# EAGLE design 1.81_Grayscale_OLED_Breakout (EAGLE 7.7.0)
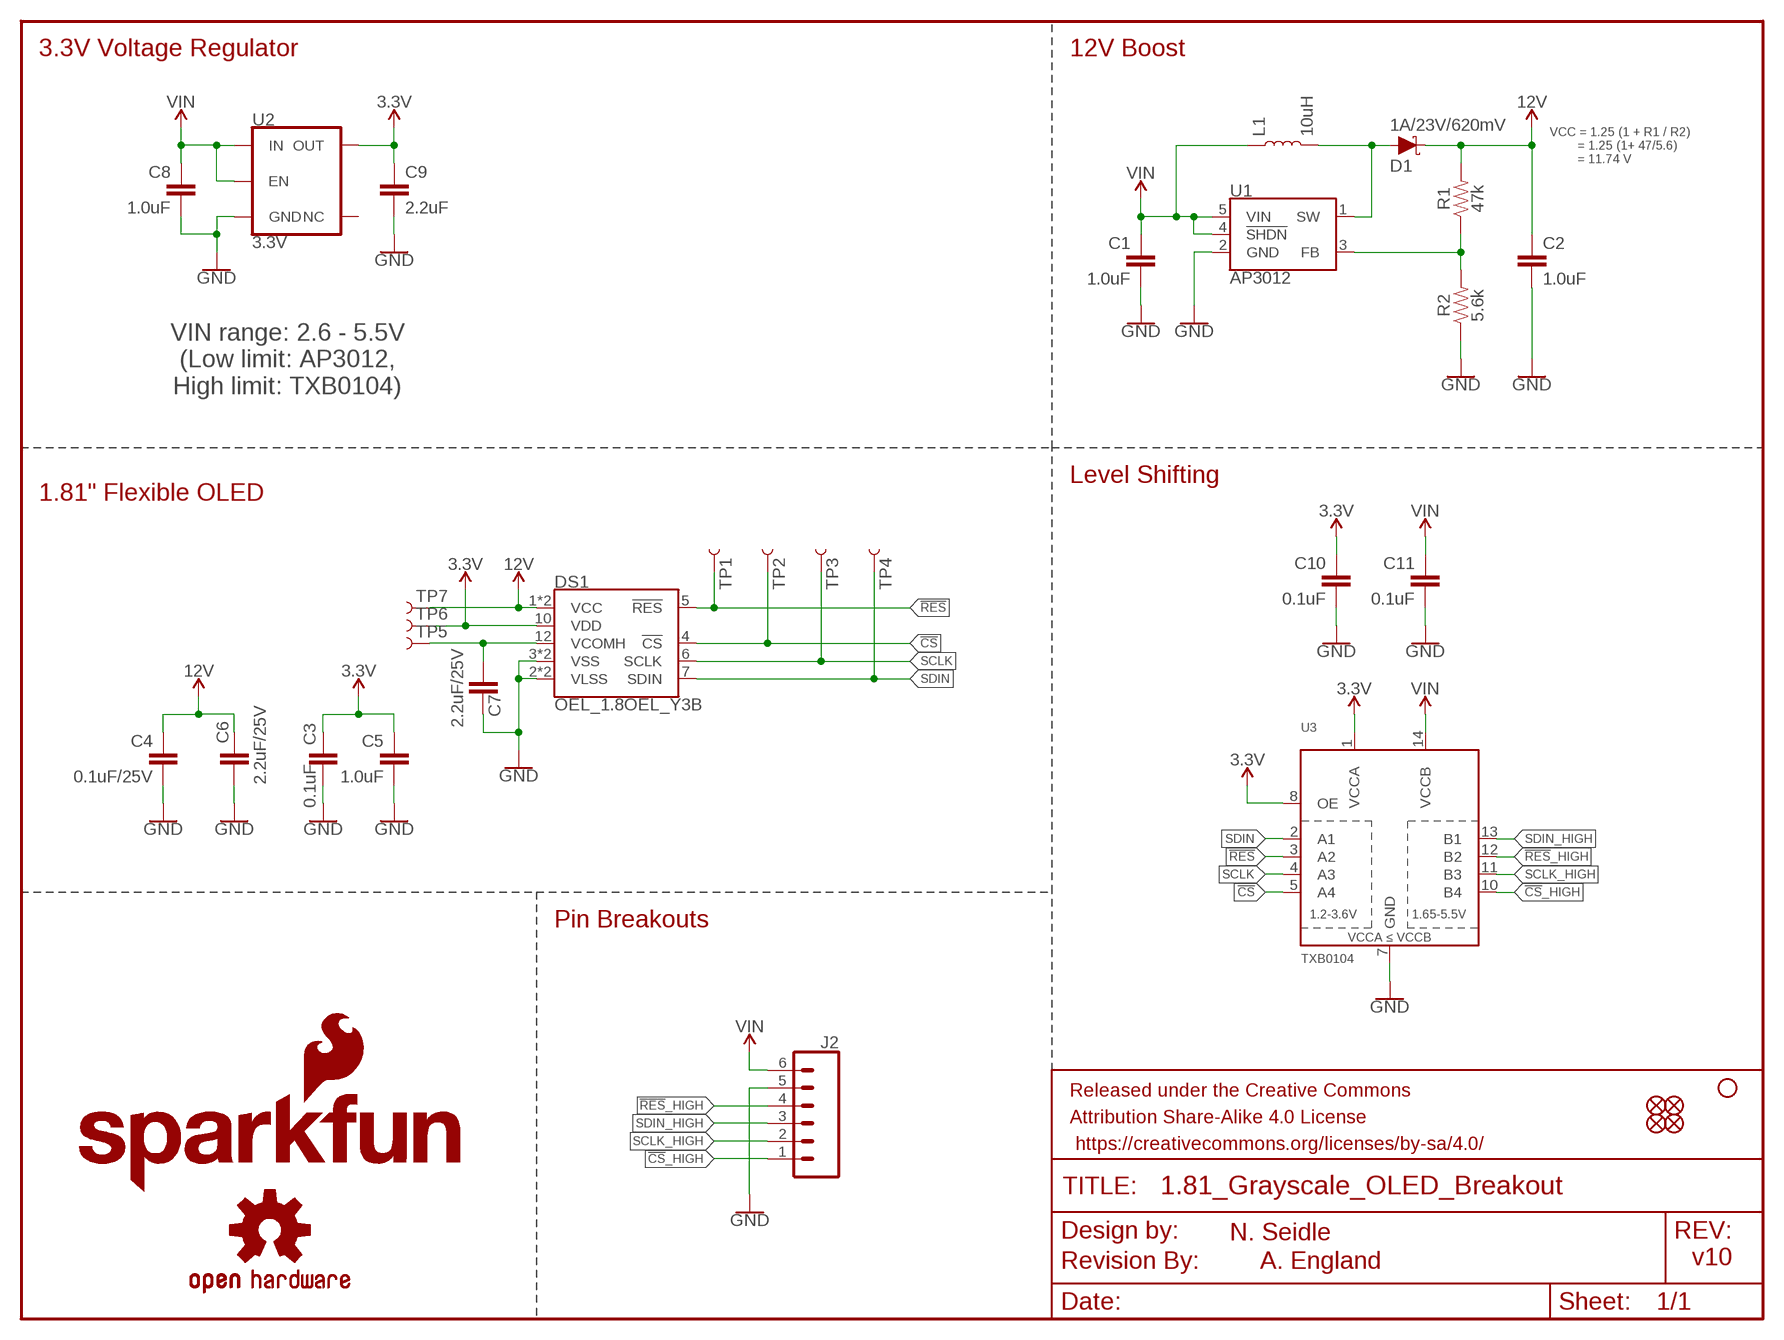
[diagram p0: schematic, sheet 1]

## Parts
C1  1.0uF  1.0UF-0603-16V-10%  [0603]
C2  1.0uF  1.0UF-0805-25V-10%  [0805]
C3  0.1uF  0.1UF-0603-25V-(+80/-20%)  [0603]
C4  0.1uF/25V  0.1UF-0603-25V-(+80/-20%)  [0603]
C5  1.0uF  1.0UF-0603-16V-10%  [0603]
C6  2.2uF/25V  2.2UF-0805-25V-(+80/-20%)  [0805]
C7  2.2uF/25V  2.2UF-0805-25V-(+80/-20%)  [0805]
C8  1.0uF  1.0UF-0603-16V-10%  [0603]
C9  2.2uF  2.2UF-0603-10V-20%  [0603]
C10  0.1uF  0.1UF-0603-25V-(+80/-20%)  [0603]
C11  0.1uF  0.1UF-0603-25V-(+80/-20%)  [0603]
D1  1A/23V/620mV  DIODE-SCHOTTKY-BAT20J  [SOD-323]
DS1  OEL_1.8OEL_Y3B  [OEL_1.8_FPC_Y3B]
FD1  FIDUCIAL1X2  [FIDUCIAL-1X2]
FD2  FIDUCIAL1X2  [FIDUCIAL-1X2]
FD3  FIDUCIAL1X2  [FIDUCIAL-1X2]
FD4  FIDUCIAL1X2  [FIDUCIAL-1X2]
FRAME1  FRAME-LETTER  [CREATIVE_COMMONS]
H2  STAND-OFF  [STAND-OFF]
J2  CONN_06NO_SILK_NO_POP  [1X06_NO_SILK]
L1  10uH  INDUCTOR-CDRH-10UH  [INDUCTOR_4.7UH]
LOGO1  SFE_LOGO_NAME_FLAME.1_INCH  [SFE_LOGO_NAME_FLAME_.1]
LOGO2  REVISION  [REVISION]
LOGO3  SFE_LOGO_FLAME.1_INCH  [SFE_LOGO_FLAME_.1]
LOGO4  OSHW-LOGOS  [OSHW-LOGO-S]
R1  47k  47KOHM-0603-1/10W-1%  [0603]
R2  5.6k  5.6KOHM-0603-1/10W-1%  [0603]
TP1  TEST-POINT3  [PAD.03X.03]
TP2  TEST-POINT3  [PAD.03X.03]
TP3  TEST-POINT3  [PAD.03X.03]
TP4  TEST-POINT3  [PAD.03X.03]
TP5  TEST-POINT3  [PAD.03X.03]
TP6  TEST-POINT3  [PAD.03X.03]
TP7  TEST-POINT3  [PAD.03X.03]
U1  AP3012  [SOT23-5]
U2  3.3V  V_REG_AP2112K-3.3V  [SOT23-5]
U3  TXB0104  TXB0104PWRSOIC14  [SO14]

## Nets
3.3V: C3.1 C5.1 C9.1 C10.1 DS1.10(VDD) TP6.P$1 U2.5(OUT) U3.1(VCCA) U3.8(OE)
12V: C2.1 C4.1 C6.1 D1.C DS1.1(VCC) DS1.13(VCC) R1.2 TP7.P$1
!CS!: DS1.4(!CS!) TP2.P$1 U3.5(A4)
!CS!_HIGH: J2.1 U3.10(B4)
!RES!: DS1.5(!RES!) TP1.P$1 U3.3(A2)
!RES!_HIGH: J2.4 U3.12(B2)
GND: C1.2 C2.2 C3.2 C4.2 C5.2 C6.2 C7.1 C8.2 C9.2 C10.2 C11.2 DS1.2(VLSS) DS1.3(VSS) DS1.8(VSS) DS1.9(VLSS) J2.5 R2.1 U1.2(GND) U2.2(GND) U3.7(GND)
N$1: C7.2 DS1.12(VCOMH) TP5.P$1
N$2: D1.A L1.P$2 U1.1(SW)
N$3: R1.1 R2.2 U1.3(FB)
SCLK: DS1.6(SCLK) TP3.P$1 U3.4(A3)
SCLK_HIGH: J2.2 U3.11(B3)
SDIN: DS1.7(SDIN) TP4.P$1 U3.2(A1)
SDIN_HIGH: J2.3 U3.13(B1)
VIN: C1.1 C8.1 C11.1 J2.6 L1.P$1 U1.4(!SHDN!) U1.5(VIN) U2.1(IN) U2.3(EN) U3.14(VCCB)
Unconnected: U2.4(NC)

## Notes on the sheet
- 3.3V Voltage Regulator | 12V Boost
- VCC = 1.25 (1 + R1 / R2)
          = 1.25 (1+ 47/5.6)
          = 11.74 V
- VIN range: 2.6 - 5.5V
  (Low limit: AP3012,
  High limit: TXB0104)
- Level Shifting
- 1.81" Flexible OLED
- Pin Breakouts
- N. Seidle
- A. England | v10

## Library data of the parts
C1 C5 C8 = SparkFun-Capacitors:1.0UF: 1µF ceramic capacitors A capacitor is a passive two-terminal electrical component used to store electrical energy temporarily in an electric field.; PROD_ID: CAP-00868
C2 = SparkFun-Capacitors:1.0UF: 1µF ceramic capacitors A capacitor is a passive two-terminal electrical component used to store electrical energy temporarily in an electric field.; PROD_ID: CAP-08064
C3 C10 C11 = SparkFun-Capacitors:0.1UF: 0.1µF ceramic capacitors A capacitor is a passive two-terminal electrical component used to store electrical energy temporarily in an electric field.; PROD_ID: CAP-00810
C4 = SparkFun-Capacitors:0.1UF: 0.1µF ceramic capacitors A capacitor is a passive two-terminal electrical component used to store electrical energy temporarily in an electric field.; PROD_ID: CAP-00810; VALUE: 0.1uF
C6 C7 = SparkFun-Capacitors:2.2UF: 2.2µF ceramic capacitors A capacitor is a passive two-terminal electrical component used to store electrical energy temporarily in an electric field.; PROD_ID: CAP-11624; VALUE: 2.2uF
C9 = SparkFun-Capacitors:2.2UF: 2.2µF ceramic capacitors A capacitor is a passive two-terminal electrical component used to store electrical energy temporarily in an electric field.; PROD_ID: CAP-07888
D1 = SparkFun-DiscreteSemi:DIODE-SCHOTTKY: Schottky diode A Schottky diode is a semiconductor diode which has a low forward voltage drop and a very fast switching action.; PROD_ID: DIO-11623
DS1 = SparkFun-Displays:OEL_1.8: WiseChip SSD1320 - 1.80" Flexible Grayscale OLED 1.80" 160*32 pixel flexible grayscale OLED display; PROD_ID: LCD-13910, CONN-13933
FD1-FD4 = SparkFun-Aesthetics:FIDUCIAL: Fiducial Alignment Points Point-of-reference for pick-and-place machines and other optical instruments.
FRAME1 = SparkFun-Aesthetics:FRAME-LETTER: Schematic Frame - Letter Standard 8.5x11 US Letter frame
H2 = SparkFun-Hardware:STAND-OFF: Stand Off Drill holes for mechanically mounting via screws, standoffs, etc. Note: Use the keepout ring to avoid running the screw head into surrounding components. Variant Overviews STAND-OFF - Mechanical footprint for a #4 phillips button head screw. STAND-OFF-TIGHT - Mechanical footprint for a #4 phillips button head screw, Example SparkFun Products Screw - Phillips Head (1/4", 4-40, 10 pack) <https://www.sparkfun.com/products/10453> (PRT-10453) Screw - Phillips Head (1/2", 4-40, 10 pack) <https://www.sparkfun.com/products/10452> (PRT-10452) Screw - Phillips Head (3/4", 4-40, 10 pack) <https://www.sparkfun.com/products/10451> (PRT-10451) Screw - Phillips Head (1", 4-40, 10 pack) <https://www.sparkfun.com/products/10450> (PRT-10450)
J2 = SparkFun-Connectors:CONN_06: Multi connection point. Often used as Generic Header-pin footprint for 0.1 inch spaced/style header connections On any of the 0.1 inch spaced packages, you can populate with these: Break Away Headers - Straight <https://www.sparkfun.com/products/116> (PRT-00116) Break Away Male Headers - Right Angle <https://www.sparkfun.com/products/553> (PRT-00553) Female Headers <https://www.sparkfun.com/products/115> (PRT-00115) Break Away Headers - Machine Pin <https://www.sparkfun.com/products/117> (PRT-00117) Break Away Female Headers - Swiss Machine Pin <https://www.sparkfun.com/products/743> (PRT-00743) Arduino Stackable Header - 6 Pin <https://www.sparkfun.com/products/9280> (PRT-09280) For SCREWTERMINALS and SPRING TERMINALS visit here: Screw Terimnals on SparkFun.com <https://www.sparkfun.com/search/results?term=Screw+Terminals> (5mm/3.5mm/2.54mm spacing) This device is also useful as a general connection point to wire up your design to another part of your project. Our various solder wires solder well into these plated through hole pads. Hook-Up Wire - Assortment (Stranded, 22 AWG) <https://www.sparkfun.com/products/11375> (PRT-11375) Hook-Up Wire - Assortment (Solid Core, 22 AWG) <https://www.sparkfun.com/products/11367> (PRT-11367) View the entire wire category on our website here <https://www.sparkfun.com/categories/141>
L1 = SparkFun-Coils:INDUCTOR: Inductors Resist changes in electrical current. Basically a coil of wire. SparkFun Products: SparkFun Load Cell Amplifier - HX711 <https://www.sparkfun.com/products/13879> IOIO-OTG - V2.2 <https://www.sparkfun.com/products/13613>; PROD_ID: NDUC-13968
LOGO1 = SparkFun-Aesthetics:SFE_LOGO_NAME_FLAME: SparkFun Font Logo w/ Flame This is the SparkFun full logo. The logo on the schematic will always be the same size; the package variant is the height of the flame part of the logo. Default layer for the logo on the board is tSilk.
LOGO2 = SparkFun-Aesthetics:REVISION: "Revision By" Text Preceding text for revisor documentation. Includes schematic text on "symbols" layer, and board text on tDoc.
LOGO3 = SparkFun-Aesthetics:SFE_LOGO_FLAME: SparkFun Flame Logo This is the SparkFun flame logo. The logo on the schematic will always be the same size; the package variant is the height of the flame. Default layer for the logo on the board is tSilk.
LOGO4 = SparkFun-Aesthetics:OSHW-LOGO: Open-Source Hardware (OSHW) Logo This logo indicates the piece of hardware it is found on incorporates a OSHW license and/or adheres to the definition of open source hardware found here: http://freedomdefined.org/OSHW
R1 = SparkFun-Resistors:47KOHM: 47kΩ resistor A resistor is a passive two-terminal electrical component that implements electrical resistance as a circuit element. Resistors act to reduce current flow, and, at the same time, act to lower voltage levels within circuits. - Wikipedia; PROD_ID: RES-07871
R2 = SparkFun-Resistors:5.6KOHM: 5.6kΩ resistor A resistor is a passive two-terminal electrical component that implements electrical resistance as a circuit element. Resistors act to reduce current flow, and, at the same time, act to lower voltage levels within circuits. - Wikipedia; PROD_ID: RES-12378
TP1-TP7 = SparkFun-Connectors:TEST-POINT: SparkFun Test Points Bare copper test points for troubleshooting or In-Circuit-Testing. These are used by our Production team for verifying production board runs using pogo-pins on test beds. SparkFun Products: SparkFun LSM9DS1 Breakout <https://www.sparkfun.com/products/13284> SparkFun PSOC <https://www.sparkfun.com/products/13714> SparkFun Load Cell Amplifier <https://www.sparkfun.com/products/13879>
U1 = SparkFun-IC-Power:AP3012: AP3012 The AP3012 is a high power, constant frequency, current mode PWM, inductor based, step-up (boost) converter. The converter operates at high frequency (1.5MHz) so that a small, low profile inductor can be used. Datasheet <https://www.diodes.com/assets/Datasheets/AP3012.pdf>; PROD_ID: VREG-13911
U2 = SparkFun-IC-Power:V_REG_AP2112: AP2112 - 600mA CMOS LDO Regulator w/ Enable The AP2112 is CMOS process low dropout linear regulator with enable function, the regulator delivers a guaranteed 600mA (min.) continuous load current. Features Output Voltage Accuracy: ±1.5% Output Current: 600mA (Min.) Foldback Short Current Protection: 50mA Enable Function to Turn ON/OFF VOUT Low Dropout Voltage (3.3V): 250mV (Typ.) @IOUT=600mA Excellent Load Regulation: 0.2%/A (Typ.) Excellent Line Regulation: 0.02%/V (Typ.) Low Quiescent Current: 55μA (Typ.) Low Standby Current: 0.01μA (Typ.) Low Output Noise: 50μVRMS PSRR: 100Hz -65dB, 1kHz -65dB OTSD Protection Stable with 1.0μF Flexible Cap: Ceramic, Tantalum and Aluminum Electrolytic Operation Temperature Range: -40°C to 85°C ESD: MM 400V, HBM 4000V; PROD_ID: VREG-12457
U3 = SparkFun-IC-Comms:TXB0104PWR: 4-Bit Bi-Directional Level Shifter 1.2V-3.6V (VCCA) to 1.65V-5.5V (VCCB) bi-directional level shifter with auto direction sensing. Max data rate - VCCA 1.8V: 20Mbps (50ns), VCCA 3.3V: 100Mbps (10ns) Digikey: 296-21929-1-ND (TSSOP) Datasheet <http://cdn.sparkfun.com/datasheets/BreakoutBoards/txb0104.pdf> SparkFun Products SparkFun Cellular Shield - MG2639 <https://www.sparkfun.com/products/13120> (CEL-13120) SparkFun Level Shifting microSD Breakout <https://www.sparkfun.com/products/13743> (DEV-13743) SparkFun Voltage-Level Translator Breakout - TXB0104 <https://www.sparkfun.com/products/11771> (BOB-11771) SparkFun Block for Intel® Edison - UART <https://www.sparkfun.com/products/13040> (DEV-13040) SparkFun Block for Intel® Edison - Arduino <https://www.sparkfun.com/products/13036> (DEV-13036); PROD_ID: IC-11329

## Board
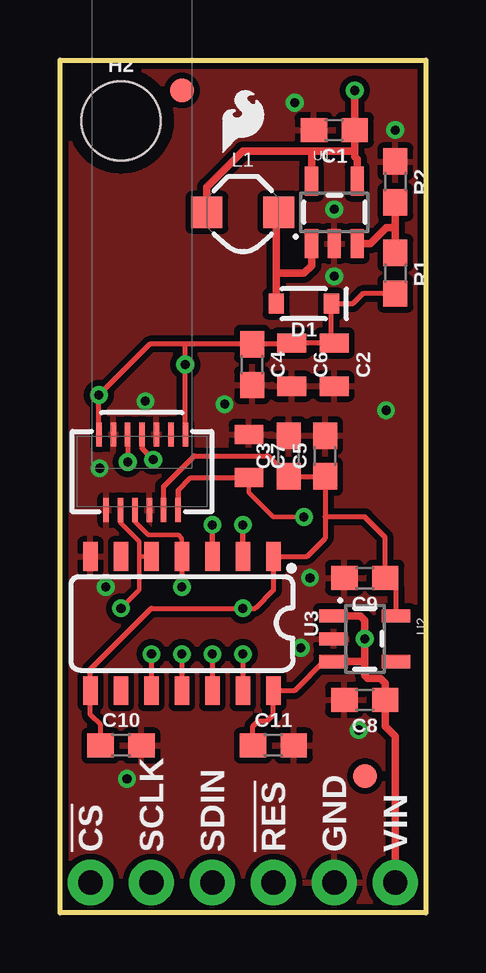
[diagram p1: board, top side]
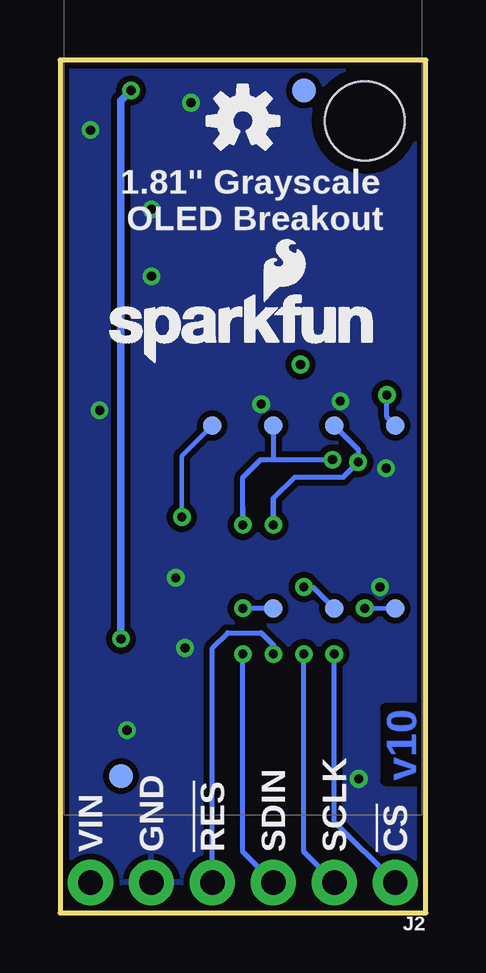
[diagram p2: board, bottom side, seen from below]

Size 15.24 x 35.56 mm. Coordinates in mm from the lower left corner, seen from the top.
Outline: 15.24,0 0,0 0,35.56 15.24,35.56 15.24,0
Copper layers (1*16): Top 0.035mm / dielectric 1.5mm / Bottom 0.035mm
Design rules "SparkFun-2-layer-TIGHT": minimum track width 7mil, minimum drill 15mil, track to track 7mil, track to pad 7mil, pad to pad 7mil, via to via 7mil, smd to smd 7mil, copper to edge 7mil, drill to drill 7mil, minimum pad ring 7mil, minimum via ring 7mil, stop-mask expansion 4mil, vias tented up to drill 25mil, thermal gap 10mil

### Footprints (pad centres in the part's own frame; a part is rotated, then mirrored left to right if it is on the bottom)
0603 = smd 1.1 x 1: 1 -0.85,0; 2 0.85,0
0805 = smd 0.8 x 1.2: 1 -0.9,0; 2 0.9,0
SOD-323 = smd 0.63 x 0.83: A 1.15,0; C -1.15,0
OEL_1.8_FPC_Y3B = smd 0.23 x 1 bottom: 1 6,-11.795; 2 5.7,-14.955; 3 5.4,-11.795; 4 5.1,-14.955; 5 4.8,-11.795; 6 4.5,-14.955; 7 4.2,-11.795; 8 3.9,-14.955; 9 3.6,-11.795; 10 3.3,-14.955; 11 3,-11.795; 12 2.7,-14.955; 13 2.4,-11.795
FIDUCIAL-1X2 = smd 1 x 1: 1 0,0
STAND-OFF = hole 3.302: 0,0
1X06_NO_SILK = drill 1.016 pad 1.88: 1 0,0; 2 2.54,0; 3 5.08,0; 4 7.62,0; 5 10.16,0; 6 12.7,0
INDUCTOR_4.7UH = smd 1.3 x 1.3: P$1 -1.5,0; P$2 1.5,0
PAD.03X.03 = smd 0.762 x 0.762: P$1 0,0
SOT23-5 = smd 0.55 x 1.2: 1 -0.95,-1.3; 2 0,-1.3; 3 0.95,-1.3; 4 0.95,1.3; 5 -0.95,1.3
SO14 = smd 0.6 x 1.2: 1 -3.81,-2.8; 2 -2.54,-2.8; 3 -1.27,-2.8; 4 0,-2.8; 5 1.27,-2.8; 6 2.54,-2.8; 7 3.81,-2.8; 8 3.81,2.8; 9 2.54,2.8; 10 1.27,2.8; 11 0,2.8; 12 -1.27,2.8; 13 -2.54,2.8; 14 -3.81,2.8

### Placement (x,y rotation side)
C1  11.43,32.64 180 top
C2  11.43,22.86 270 top
C3  9.53,19.05 90 top
C4  8,22.86 270 top
C5  11.05,19.05 90 top
C6  9.65,22.86 270 top
C7  7.87,19.05 270 top
C8  12.7,8.89 180 top
C9  12.7,13.97 180 top
C10  2.54,6.99 0 top
C11  8.89,6.99 0 top
D1  10.16,25.4 180 top
DS1  7.62,31.75 0 bottom
FD1  12.7,5.71 0 top
FD2  5.08,34.29 0 top
FD3  12.7,5.71 0 bottom
FD4  5.08,34.29 0 bottom
FRAME1  -22.86,-8.89 0 top  (outside the outline)
H2  2.54,33.02 0 top
J2  1.27,1.27 180 bottom
L1  7.62,29.21 0 top
LOGO1  13.59,22.86 0 bottom
LOGO2  -11.43,-11.43 0 top  (outside the outline)
LOGO3  6.48,31.37 0 top
LOGO4  7.62,33.02 0 bottom
R1  13.97,26.67 270 top
R2  13.97,30.48 270 top
TP1  3.81,20.32 0 bottom
TP2  1.27,12.7 0 bottom
TP3  3.81,12.7 0 bottom
TP4  6.35,20.32 0 bottom
TP5  8.89,20.32 0 bottom
TP6  6.35,12.7 0 bottom
TP7  1.27,20.32 0 bottom
U1  11.43,29.21 0 top
U2  12.7,11.43 270 top
U3  5.08,12.06 180 top

### Tracks (layer width: path | path; a pad name or v marks a point on that pad's centre or on a via)
3.3V  (via drill 0.38)
  Top 0.203: U2.5 14,13.52 C9.1 13.55,15.66 12.7,16.51 11.05,16.51 | 11.05,16.51 C5.1 C3.1 8.68,19.05 5.59,19.05 4.32,17.78 DS1.10 | 11.05,16.51 11.05,15.62 10.29,14.87 U3.1 8.89,13.46 8.13,12.7 v7.62,12.7 3.81,12.7 1.27,10.16 U3.8 1.27,8.26 1.69,7.83 C10.1
  Bottom 0.203: TP6.P$1 v7.62,12.7
12V  (via drill 0.38)
  Top 0.203: DS1.1 v1.62,21.59 3.74,23.71 5.21,23.71 | 5.21,23.71 C4.1 9.6,23.71 C6.1 C2.1 11.31,23.88 D1.C 12.19,25.4 12.61,25.82 R1.2 | DS1.13 v5.22,22.86 5.22,23.7 5.21,23.71
  Bottom 0.203: 5.08,22.72 v5.22,22.86 | TP7.P$1 1.62,20.67 v1.62,21.59
!CS!  (via drill 0.38)
  Top 0.178: U3.5 3.3,14.87 | DS1.4 2.52,16.28 3.3,15.49 3.3,14.87 | 3.3,14.87 3.3,13.46 v2.54,12.7
  Bottom 0.178: v2.54,12.7 TP2.P$1
!CS!_HIGH  (via drill 0.38)
  Top 0.203: v3.81,10.79 U3.10
  Bottom 0.203: J2.1 3.81,3.81 v3.81,10.79
!RES!  (via drill 0.38)
  Top 0.203: DS1.5 v2.82,18.8
  Top 0.229: v6.35,16.18 U3.3
  Bottom 0.203: 6.35,17.27 5.46,18.16 3.46,18.16 v2.82,18.8 2.82,19.33 TP1.P$1
  Bottom 0.229: 6.35,17.27 v6.35,16.18
!RES!_HIGH  (via drill 0.38)
  Top 0.203: v6.35,10.79 U3.12
  Bottom 0.203: J2.4 8.89,11.05 8.26,11.68 6.86,11.68 6.35,11.18 v6.35,10.79
GND  (via drill 0.38)
  other vias: 6.86,21.21 10.03,11.05 12.45,7.62 1.65,18.54 13.59,20.95 11.43,26.54 11.43,29.34 9.78,33.78 2.79,5.59 10.41,13.97 13.97,32.64 3.56,21.34 1.91,13.59
  pour Top (isolate 0.254): 15.24,35.56 0,35.56 0,0 15.24,0
  pour Bottom (isolate 0.254): 0,35.56 15.24,35.56 15.24,0 0,0
N$1  (via drill 0.38)
  Top 0.178: C7.2 7.87,17.53 8.89,16.51 v10.16,16.51
  Top 0.203: 4.92,17.62 5.45,18.15 C7.2
  Top 0.229: DS1.12 4.92,17.62
  Bottom 0.178: v10.16,16.51 10.16,19.05 TP5.P$1
N$2
  Top 0.254: 9.01,29.1 L1.P$2
  Top 0.305: U1.1 10.48,26.99 10.16,26.67 9.01,26.67 | D1.A 9.01,26.67 | 9.01,26.67 9.01,29.1
N$3
  Top 0.305: 13.97,28.57 13.59,28.57 12.92,27.91 U1.3 | 13.97,28.57 R1.1 | 13.97,28.57 R2.2
SCLK  (via drill 0.38)
  Top 0.178: U3.4 5.08,15.62 4.95,15.75 3.68,15.75 3.12,16.31 DS1.6
  Top 0.203: U3.4 v5.08,13.59
  Bottom 0.203: v5.08,13.59 4.7,13.59 TP3.P$1
SCLK_HIGH  (via drill 0.38)
  Top 0.203: v5.08,10.79 U3.11
  Bottom 0.203: J2.2 5.08,2.54 v5.08,10.79
SDIN  (via drill 0.38)
  Top 0.203: DS1.7 3.42,19.36 v3.89,18.9
  Top 0.229: v7.62,16.18 U3.2
  Bottom 0.203: 6.35,18.9 v3.89,18.9 | TP4.P$1 6.35,18.9 | 7.62,16.89 7.62,18.16 6.88,18.9 6.35,18.9
  Bottom 0.229: 7.62,16.89 v7.62,16.18
SDIN_HIGH  (via drill 0.38)
  Top 0.203: v7.62,10.79 U3.13
  Bottom 0.203: J2.3 7.62,2.54 v7.62,10.79
VIN  (via drill 0.38)
  Top 0.203: U2.3 10.99,10.48 9.77,9.27 U3.14 8.89,8.26 8.64,8 8.26,8 8.04,7.79 C11.1
  Top 0.305: 12.7,10.48 v12.7,11.43 12.7,12.19 12.51,12.38 U2.1 | U2.3 12.7,10.48 | v12.28,34.29 C1.1 12.28,31.75 | J2.6 13.97,7.37 13.55,7.79 C8.1 13.55,9.56 13.34,9.78 12.83,9.78 12.7,9.91 12.7,10.48 | U1.4 12.38,31.43 12.28,31.53 12.28,31.75 | 10.48,31.75 7.62,31.75 6.12,30.25 L1.P$1 | 10.48,31.75 12.28,31.75 | U1.5 10.48,31.75
  Bottom 0.305: v12.7,11.43 12.7,33.87 v12.28,34.29

### Text on the board
Bottom: v10
tPlace: !CS! | SCLK | SDIN | !RES! | GND | VIN
bPlace: 1.81" Grayscale / OLED Breakout | !CS! | SCLK | SDIN | !RES! | GND | VIN
Measures: Units in Inches
tDocu: N. Seidle | A. England